# Altium schematic sheet 06.SchDoc
size 420 x 297 mm
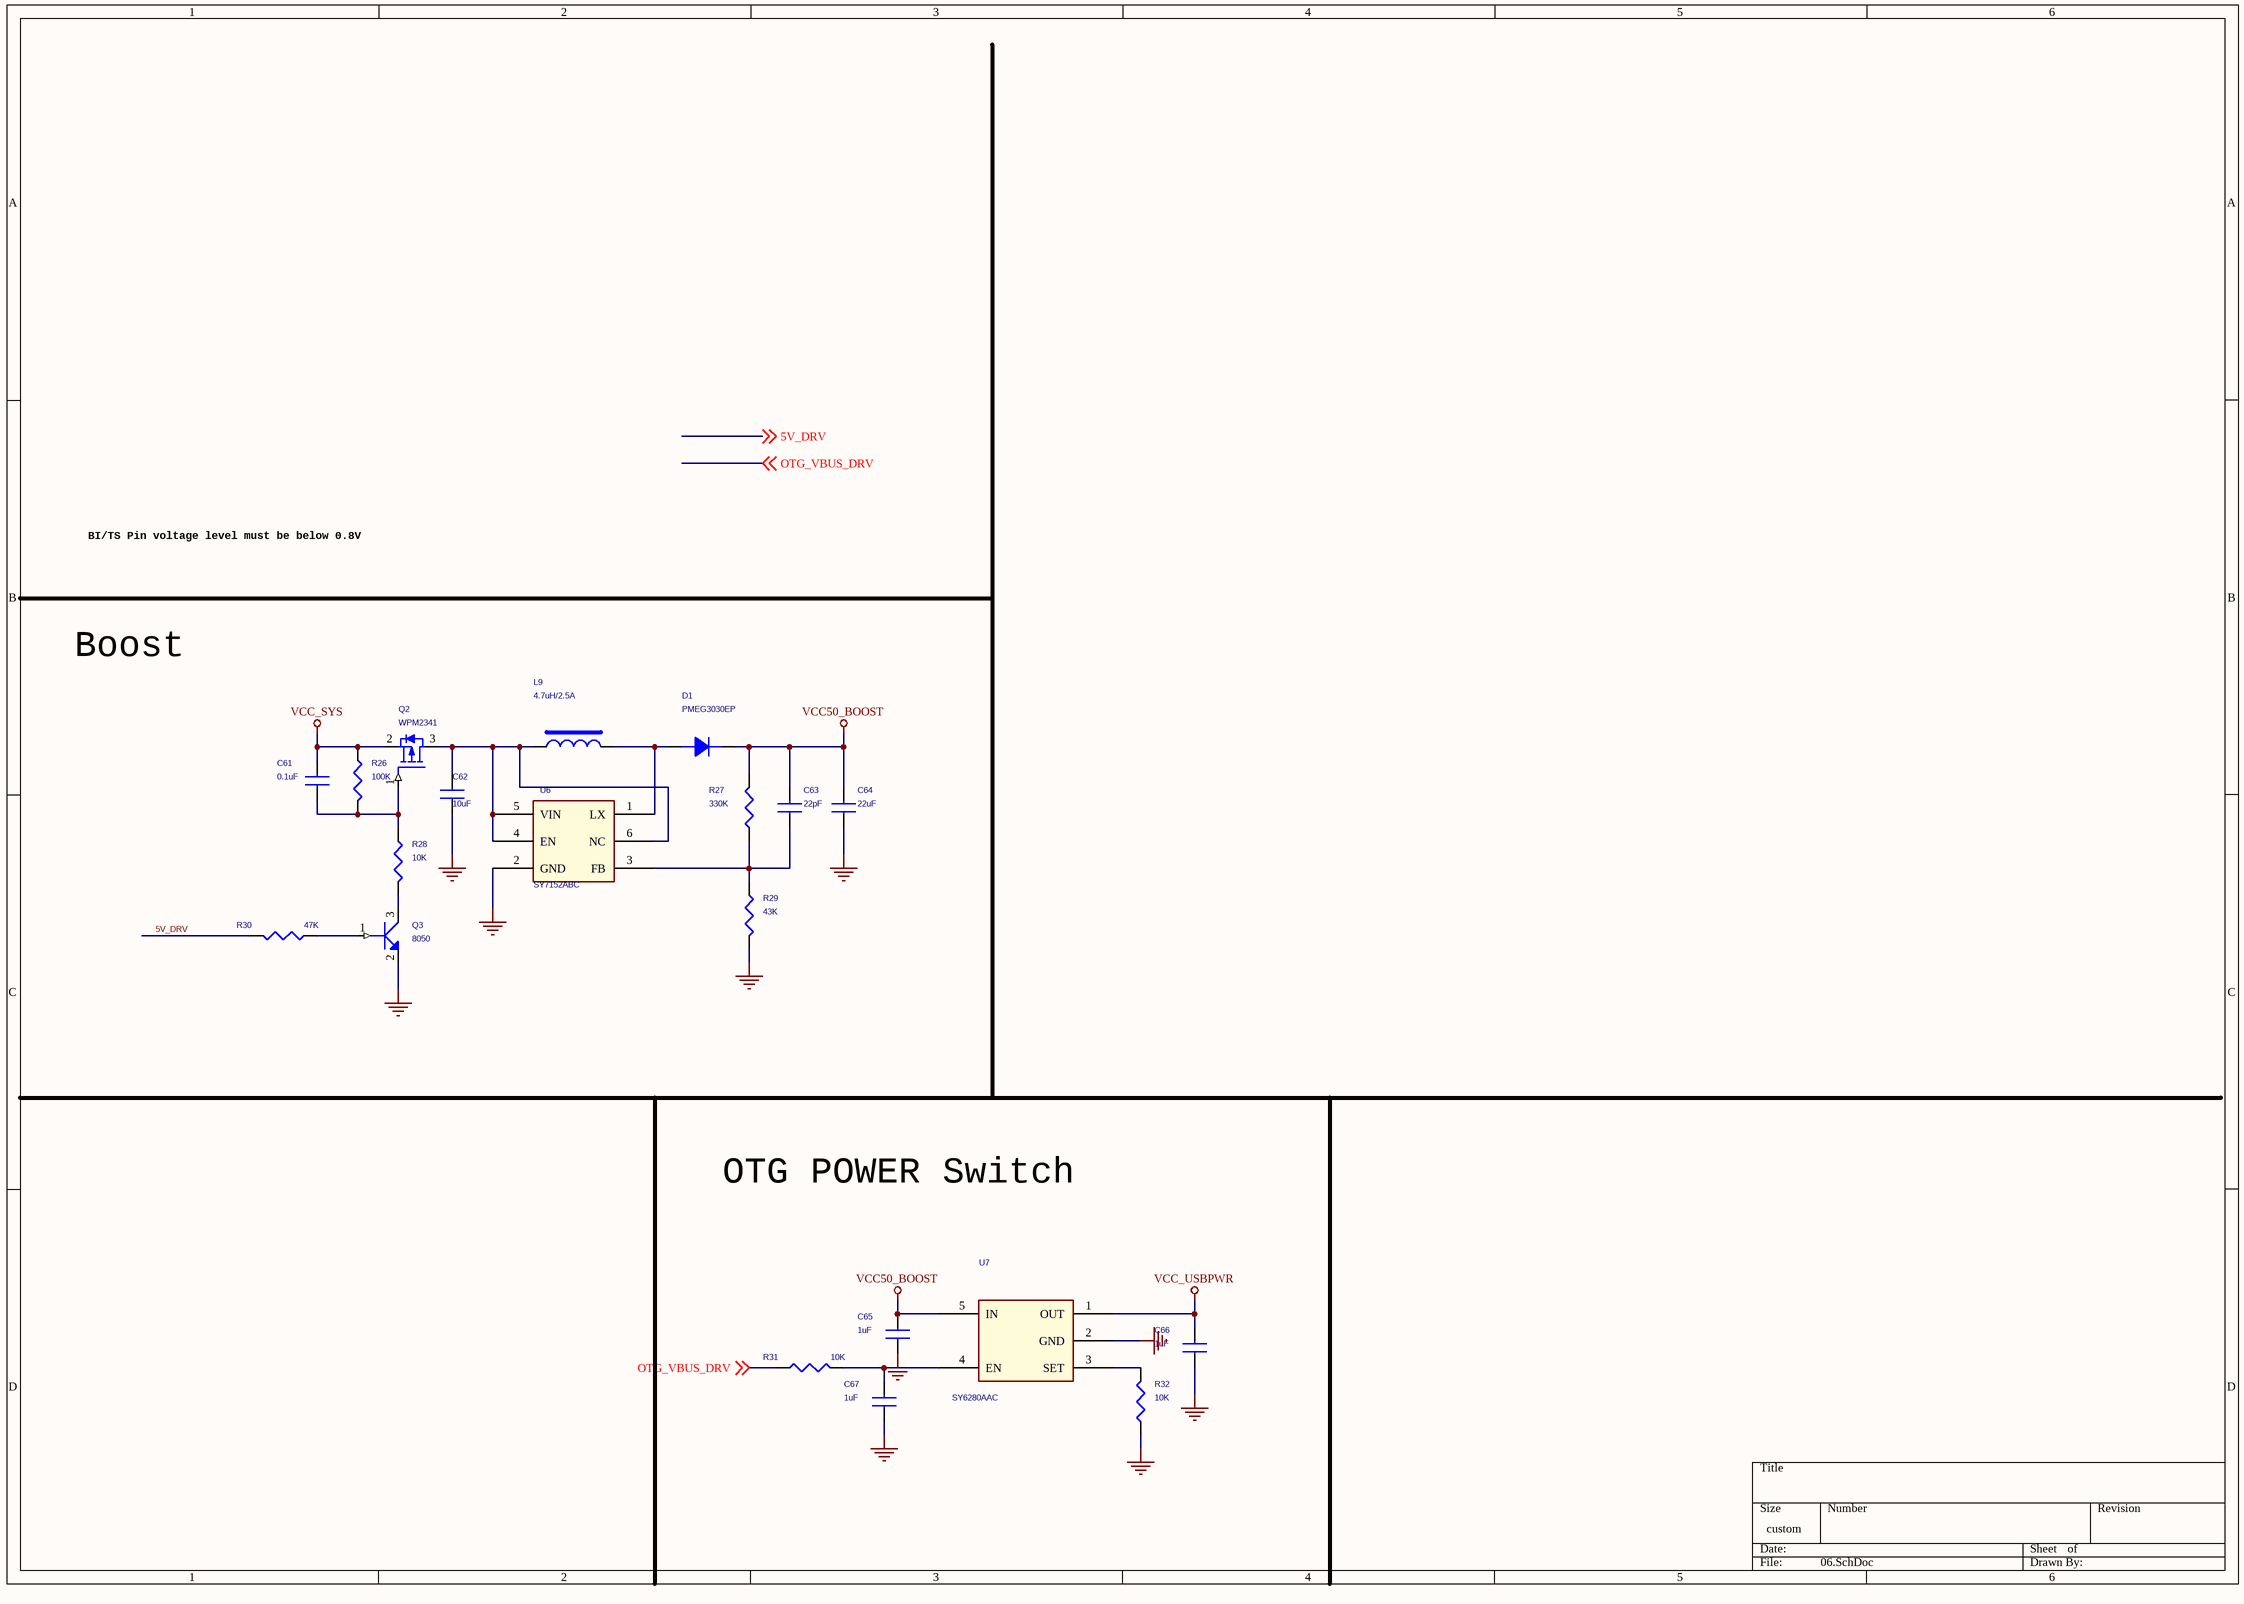
[diagram p0: 06.SchDoc]

## Parts
C61  0.1uF  [C0603]
C62  10uF  [C0603]
C63  22pF  [C0603]
C64  22uF  [C0603]
C65  1uF  [C0603]
C66  1uF  [C0603]
C67  1uF  [C0603]
D1  PMEG3030EP  [DO214AC]
L9  4.7uH/2.5A  [IND-3X3]
Q2  WPM2341  [SOT23]
Q3  8050  [SOT23]
R26  100K  [r0402]
R27  330K  [r0402]
R28  10K  [r0402]
R29  43K  [r0402]
R30  47K  [r0402]
R31  10K  [R0402]
R32  10K  [R0402]
U6  SY7152ABC  [SOT26]
U7  SY6280AAC  [SOT25]

## Nets
GND: C62.1 C64.1 C65.1 C66.1 C67.1 Q3.2(E) R29.2 R32.1 U6.2(GND) U7.2(GND)
VCC50_BOOST: C63.2 C64.2 C65.2 D1.2(K) R27.1 U7.5(IN)
VCC_SYS: C61.2 Q2.2(SOURCE) R26.2
VCC_USBPWR: C66.2 U7.1(OUT)
5V_DRV: R30.1 ; off-sheet 5V_DRV
OTG_VBUS_DRV: R31.2 ; off-sheet OTG_VBUS_DRV
NetC61_1: C61.1 Q2.1(GATE) R26.1 R28.2
NetC62_2: C62.2 L9.1 Q2.3(DRAIN) U6.4(EN) U6.5(VIN) U6.6(NC)
NetC63_1: C63.1 R27.2 R29.1 U6.3(FB)
NetC67_2: C67.2 R31.1 U7.4(EN)
NetD1_1: D1.1(A) L9.2 U6.1(LX)
NetQ3_1: Q3.1(B) R30.2
NetQ3_3: Q3.3(C) R28.1
NetR32_2: R32.2 U7.3(SET)

## Notes on the sheet
- BI/TS Pin voltage level must be below 0.8V
- Boost
- OTG POWER Switch

## Library data of the parts
C61 C65-C67 = CAP NP_Dup3: RoHS CHIP CAP 0.1uF +10/-10% X7R
C62 C64 = CAP NP_Dup3: RoHS CHIP CAP 10uF +10/-10% X5R; MARK: 106
C63 = CAP NP_Dup3: RoHS CHIP CAP 22pF 1% NPO
D1 = DIODE_Dup2: RoHS 1.0A SURFACE MOUNT SCHOTTKY BARRIER RECTIFIER 1N5819
L9 = INDUCTOR_1: CoilInd,Shielded(SHLD),4.7uH@100KHz,+/-30%,1.5A,45mOhm,SMD,4.0*4.0*2.0
Q2 = MOSFET P: MOSFET-P,WPM2341 ,-20V,+/-8V,-2.8A,56m Ohm@Vgs=-2.5V,44m Ohm@Vgs=-4.5V,SOT23; ROOM: CHG
Q3 = NPN4
R26 = RES 1B_Dup1: ROHS CHIP RES 100K 1/16W 1%
R27 = RESISTOR_0_Dup2: ROHS CHIP RES 330K 1/16W +/-5%; MARK: 51K
R28 R30 = RESISTOR_1_Dup2: RES,thick film,47KOhm,+/-5%,1/16W,SMD0402
R29 = RESISTOR_0_Dup2: ROHS CHIP RES 43K 1/16W +/-5%; MARK: 51K
R31 = RESISTOR_Dup1: ROHS CHIP RES 4.7K 1/16W +/-5%
R32 = RESISTOR_Dup1: ROHS CHIP RES 10K 1/16W +/-5%
U6 = G5121_1: SY7208/TCS9208/LP6218 High Efficiency 1MHz, 2A Step Up Regulator
U7 = LPW5206H: Power switch,LPW5206H,2.4V~5.5V,SOT23-5,-40°C~+ 85°C; MARK: RT9701/G5250